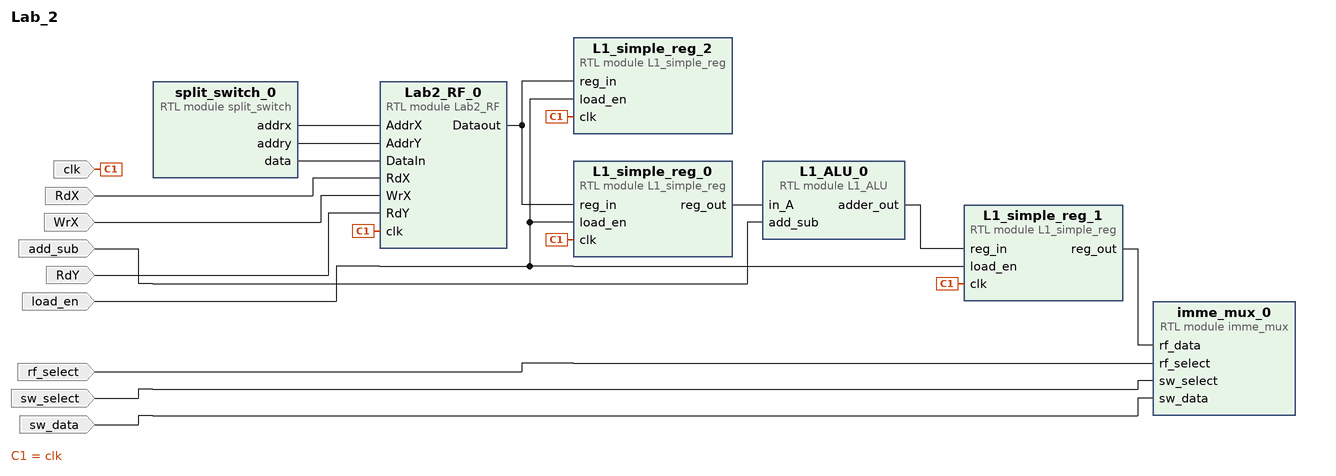
[diagram p0: block diagram of the top level]
# Vivado block design Lab_2, xc7a100tcsg324-2, Vivado 2019.1
create_bd_design Lab_2

create_bd_port -dir I add_sub
create_bd_port -dir I -type clk clk
set_property -dict {CONFIG.FREQ_HZ 10000000000} [get_bd_ports clk]
create_bd_port -dir I load_en
create_bd_port -dir I rf_select
create_bd_port -dir I sw_select
create_bd_port -dir I sw_data
create_bd_port -dir I RdX
create_bd_port -dir I RdY
create_bd_port -dir I WrX

create_bd_cell -type module -reference Lab2_RF Lab2_RF_0
create_bd_cell -type module -reference L1_ALU L1_ALU_0
create_bd_cell -type module -reference L1_simple_reg L1_simple_reg_0
create_bd_cell -type module -reference L1_simple_reg L1_simple_reg_1
create_bd_cell -type module -reference L1_simple_reg L1_simple_reg_2
create_bd_cell -type module -reference imme_mux imme_mux_0
create_bd_cell -type module -reference split_switch split_switch_0

# ---- connections ----

connect_bd_net [get_bd_pins L1_simple_reg_0/reg_out] [get_bd_pins L1_ALU_0/in_A]
connect_bd_net [get_bd_pins L1_ALU_0/adder_out] [get_bd_pins L1_simple_reg_1/reg_in]
connect_bd_net [get_bd_pins Lab2_RF_0/Dataout] [get_bd_pins L1_simple_reg_0/reg_in] [get_bd_pins L1_simple_reg_2/reg_in]
connect_bd_net [get_bd_ports clk] \
  [get_bd_pins Lab2_RF_0/clk] [get_bd_pins L1_simple_reg_2/clk] [get_bd_pins L1_simple_reg_0/clk] \
  [get_bd_pins L1_simple_reg_1/clk]
connect_bd_net [get_bd_ports add_sub] [get_bd_pins L1_ALU_0/add_sub]
connect_bd_net [get_bd_ports load_en] \
  [get_bd_pins L1_simple_reg_0/load_en] [get_bd_pins L1_simple_reg_1/load_en] [get_bd_pins L1_simple_reg_2/load_en]
connect_bd_net [get_bd_pins L1_simple_reg_1/reg_out] [get_bd_pins imme_mux_0/rf_data]
connect_bd_net [get_bd_ports rf_select] [get_bd_pins imme_mux_0/rf_select]
connect_bd_net [get_bd_ports sw_select] [get_bd_pins imme_mux_0/sw_select]
connect_bd_net [get_bd_ports sw_data] [get_bd_pins imme_mux_0/sw_data]
connect_bd_net [get_bd_ports RdX] [get_bd_pins Lab2_RF_0/RdX]
connect_bd_net [get_bd_ports WrX] [get_bd_pins Lab2_RF_0/WrX]
connect_bd_net [get_bd_ports RdY] [get_bd_pins Lab2_RF_0/RdY]
connect_bd_net [get_bd_pins split_switch_0/addrx] [get_bd_pins Lab2_RF_0/AddrX]
connect_bd_net [get_bd_pins split_switch_0/addry] [get_bd_pins Lab2_RF_0/AddrY]
connect_bd_net [get_bd_pins split_switch_0/data] [get_bd_pins Lab2_RF_0/DataIn]

validate_bd_design
save_bd_design
